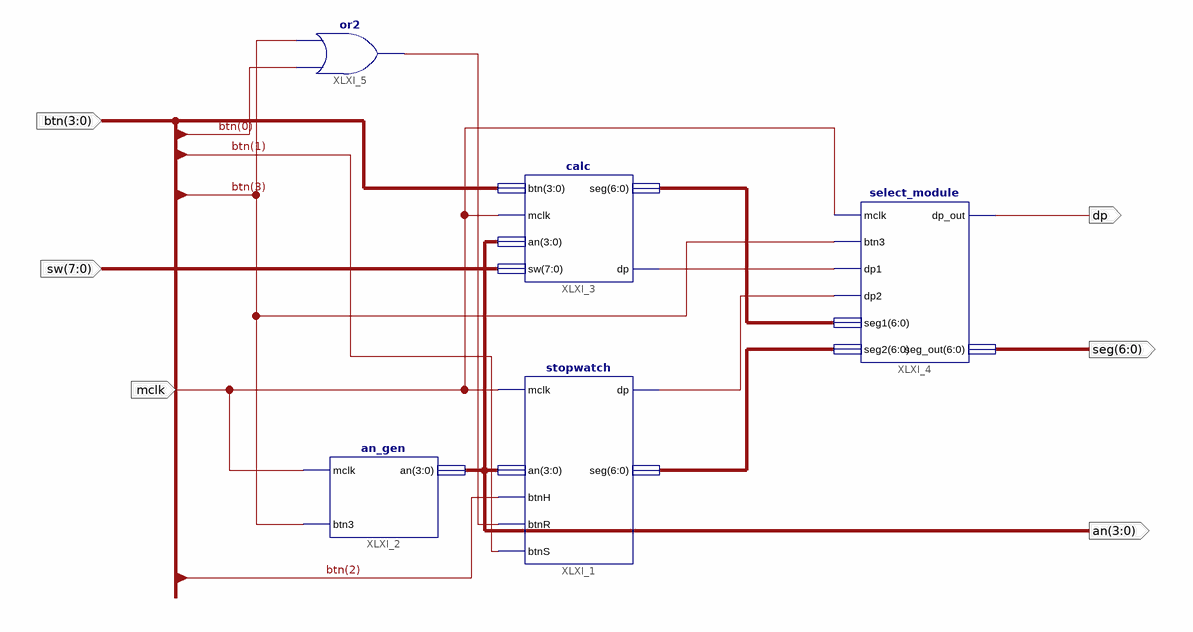
[diagram p0: schematic sheet 1]
// Xilinx ISE schematic lab4.sch (spartan3e) as structural Verilog: 5 symbols, 6 ports
module lab4 (
  input  [3:0] btn,
  input  mclk,
  input  [7:0] sw,
  output [3:0] an,
  output dp,
  output [6:0] seg
);

  wire XLXN_17, XLXN_18, XLXN_26;
  wire [6:0] XLXN_16, XLXN_19;

  stopwatch XLXI_1 (.mclk(mclk), .btnR(XLXN_26), .btnS(btn[1]), .an(an), .btnH(btn[2]), .dp(XLXN_18), .seg(XLXN_19));
  an_gen XLXI_2 (.mclk(mclk), .an(an), .btn3(btn[3]));
  calc XLXI_3 (.btn(btn), .mclk(mclk), .an(an), .sw(sw), .seg(XLXN_16), .dp(XLXN_17));
  select_module XLXI_4 (
    .mclk(mclk), .btn3(btn[3]), .dp1(XLXN_17), .dp2(XLXN_18), .seg1(XLXN_16), .seg2(XLXN_19), .dp_out(dp),
    .seg_out(seg));
  or XLXI_5 (XLXN_26, btn[0], btn[3]);
endmodule
